# EAGLE design Teensy-Maxuino-Slave-A4988-stepper 2x shield v3 (EAGLE 6.4)
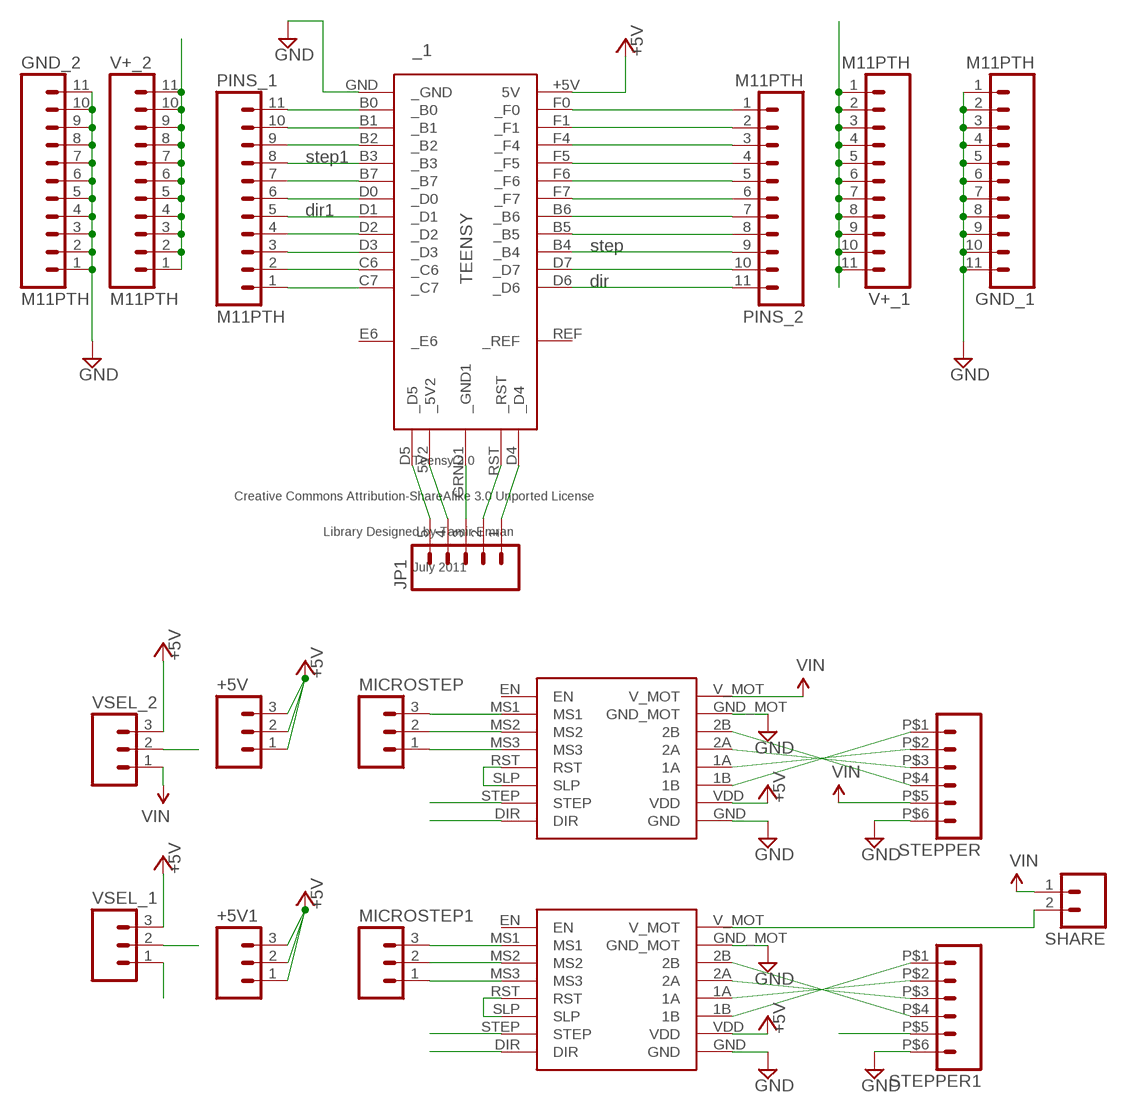
[diagram p0: schematic, sheet 1]

## Parts
+5V  M03PTH  [1X03]
+5V1  M03PTH  [1X03]
_1  TEENSY  [TEENSY]
A4988_1  POLOLU_A4988  [POLOLU_A4988]
A4988_2  POLOLU_A4988  [POLOLU_A4988]
GND_1  M11PTH  [1X11]
GND_2  M11PTH  [1X11]
JP1  M05PTH  [1X05]
MICROSTEP  M03PTH  [1X03]
MICROSTEP1  M03PTH  [1X03]
PINS_1  M11PTH  [1X11]
PINS_2  M11PTH  [1X11]
SHARE  M02PTH  [1X02]
STEPPER  M06  [SPRINGTERMINAL-2.54MM-6]
STEPPER1  M06  [SPRINGTERMINAL-2.54MM-6]
V+_1  M11PTH  [1X11]
V+_2  M11PTH  [1X11]
VSEL_1  M03PTH  [1X03]
VSEL_2  M03PTH  [1X03]

## Nets
+5V: +5V1.1 +5V1.2 +5V1.3 +5V.1 +5V.2 +5V.3 _1.5V2(_5V2) _1.+5V(5V) A4988_1.VDD A4988_2.VDD JP1.4 VSEL_1.3 VSEL_2.3
DIR: _1.D6(_D6) A4988_1.DIR PINS_2.11
DIR1: _1.D1(_D1) A4988_2.DIR PINS_1.5
GND [GND]: _1.GND(_GND) _1.GRND1(_GND1) A4988_1.GND A4988_1.GND_MOT A4988_2.GND A4988_2.GND_MOT GND_1.1 GND_1.2 GND_1.3 GND_1.4 GND_1.5 GND_1.6 GND_1.7 GND_1.8 GND_1.9 GND_1.10 GND_1.11 GND_2.1 GND_2.2 GND_2.3 GND_2.4 GND_2.5 GND_2.6 GND_2.7 GND_2.8 GND_2.9 GND_2.10 GND_2.11 JP1.3 STEPPER1.P$6 STEPPER.P$6
N$1 [Power]: A4988_1.2B STEPPER.P$4
N$2 [Power]: A4988_1.2A STEPPER.P$3
N$3 [Power]: A4988_1.1A STEPPER.P$2
N$4 [Power]: A4988_1.1B STEPPER.P$1
N$5: A4988_2.RST A4988_2.SLP
N$6: A4988_1.RST A4988_1.SLP
N$7: A4988_2.MS1 MICROSTEP1.3
N$8: A4988_1.MS1 MICROSTEP.3
N$9: A4988_1.MS2 MICROSTEP.2
N$10: A4988_1.MS3 MICROSTEP.1
N$11: A4988_2.MS2 MICROSTEP1.2
N$12: A4988_2.MS3 MICROSTEP1.1
N$13: A4988_2.2B STEPPER1.P$4
N$14 [Power]: A4988_2.2A STEPPER1.P$3
N$15 [Power]: A4988_2.1A STEPPER1.P$2
N$16 [Power]: A4988_2.1B STEPPER1.P$1
N$17: _1.B0(_B0) PINS_1.11
N$18: _1.D0(_D0) PINS_1.6
N$19: _1.B7(_B7) PINS_1.7
N$20: _1.C6(_C6) PINS_1.2
N$21: _1.D3(_D3) PINS_1.3
N$22: _1.D2(_D2) PINS_1.4
N$23: _1.C7(_C7) PINS_1.1
N$24: _1.B2(_B2) PINS_1.9
N$25: _1.B1(_B1) PINS_1.10
N$26: _1.F4(_F4) PINS_2.3
N$27: _1.F5(_F5) PINS_2.4
N$28: _1.F6(_F6) PINS_2.5
N$29: _1.F7(_F7) PINS_2.6
N$30: _1.B6(_B6) PINS_2.7
N$31: _1.B5(_B5) PINS_2.8
N$32: _1.D7(_D7) PINS_2.10
N$33: _1.F0(_F0) PINS_2.1
N$34: _1.F1(_F1) PINS_2.2
N$35: _1.D5(_D5) JP1.5
N$38: _1.RST(_RST) JP1.2
N$39: _1.D4(_D4) JP1.1
STEP: _1.B4(_B4) A4988_1.STEP PINS_2.9
STEP1: _1.B3(_B3) A4988_2.STEP PINS_1.8
V+_1: V+_1.1 V+_1.2 V+_1.3 V+_1.4 V+_1.5 V+_1.6 V+_1.7 V+_1.8 V+_1.9 V+_1.10 V+_1.11 VSEL_1.2
V+_2: V+_2.1 V+_2.2 V+_2.3 V+_2.4 V+_2.5 V+_2.6 V+_2.7 V+_2.8 V+_2.9 V+_2.10 V+_2.11 VSEL_2.2
VIN [Power]: A4988_1.V_MOT SHARE.1 STEPPER.P$5 VSEL_2.1
VIN_2 [Power]: A4988_2.V_MOT SHARE.2 STEPPER1.P$5 VSEL_1.1
Unconnected: _1.E6(_E6) _1.REF(_REF) A4988_1.EN A4988_2.EN

## Notes on the sheet
- step1
- dir1
- step
- dir

## Library data of the parts
+5V +5V1 MICROSTEP MICROSTEP1 VSEL_1 VSEL_2 = SparkFun-Connectors:M03: Header 3 Standard 3-pin 0.1" header. Use with straight break away headers (SKU : PRT-00116), right angle break away headers (PRT-00553), swiss pins (PRT-00743), machine pins (PRT-00117), and female headers (PRT-00115). Molex polarized connector foot print use with SKU : PRT-08232 with associated crimp pins and housings.
_1 = aliEagleLib:TEENSY: Teensy 2.0 Original Design by Clint Fisher Modified Design by Tamir Emran Licensed Under Creative Commons Attribution-ShareAlike 3.0 Unported (CC BY-SA 3.0)
A4988_1 A4988_2 = aliEagleLib:POLOLU_A4988
GND_1 GND_2 PINS_1 PINS_2 V+_1 V+_2 = SparkFun-Connectors:M11: Header 11 Standard 11-pin 0.1" header. Use with straight break away headers (SKU : PRT-00116), right angle break away headers (PRT-00553), swiss pins (PRT-00743), machine pins (PRT-00117), and female headers (PRT-00115).
JP1 = SparkFun-Connectors:M05: Header 5 Standard 5-pin 0.1" header. Use with straight break away headers (SKU : PRT-00116), right angle break away headers (PRT-00553), swiss pins (PRT-00743), machine pins (PRT-00117), and female headers (PRT-00115). Molex polarized connector foot print use with SKU : PRT-08230 with associated crimp pins and housings.
SHARE = SparkFun-Connectors:M02: Header 2 Standard 2-pin 0.1" header. Use with straight break away headers (SKU : PRT-00116), right angle break away headers (PRT-00553), swiss pins (PRT-00743), machine pins (PRT-00117), and female headers (PRT-00115). Molex polarized connector foot print use with SKU : PRT-08233 with associated crimp pins and housings.
STEPPER STEPPER1 = aliEagleLib:M06: Header 6 Standard 6-pin 0.1" header. Use with straight break away headers (SKU : PRT-00116), right angle break away headers (PRT-00553), swiss pins (PRT-00743), machine pins (PRT-00117), and female headers (PRT-00115). Molex polarized connector foot print use with SKU : PRT-08094 with associated crimp pins and housings. NOTES ON THE VARIANTS LOCK and LOCK_LONGPADS... This footprint was designed to help hold the alignment of a through-hole component (i.e. 6-pin header) while soldering it into place. You may notice that each hole has been shifted either up or down by 0.005 of an inch from it's more standard position (which is a perfectly straight line). This slight alteration caused the pins (the squares in the middle) to touch the edges of the holes. Because they are alternating, it causes a "brace" to hold the component in place. 0.005 has proven to be the perfect amount of "off-center" position when using our standard breakaway headers. Although looks a little odd when you look at the bare footprint, once you have a header in there, the alteration is very hard to notice. Also, if you push a header all the way into place, it is covered up entirely on the bottom side. This idea of altering the position of holes to aid alignment will be further integrated into the Sparkfun Library for other footprints. It can help hold any component with 3 or more connection pins.

## Net classes
0 default: width 0.152 mm, clearance 0.152 mm
1 GND: width 0.406 mm, clearance 0.152 mm
2 Power: width 0.406 mm, clearance 0.152 mm

## Board
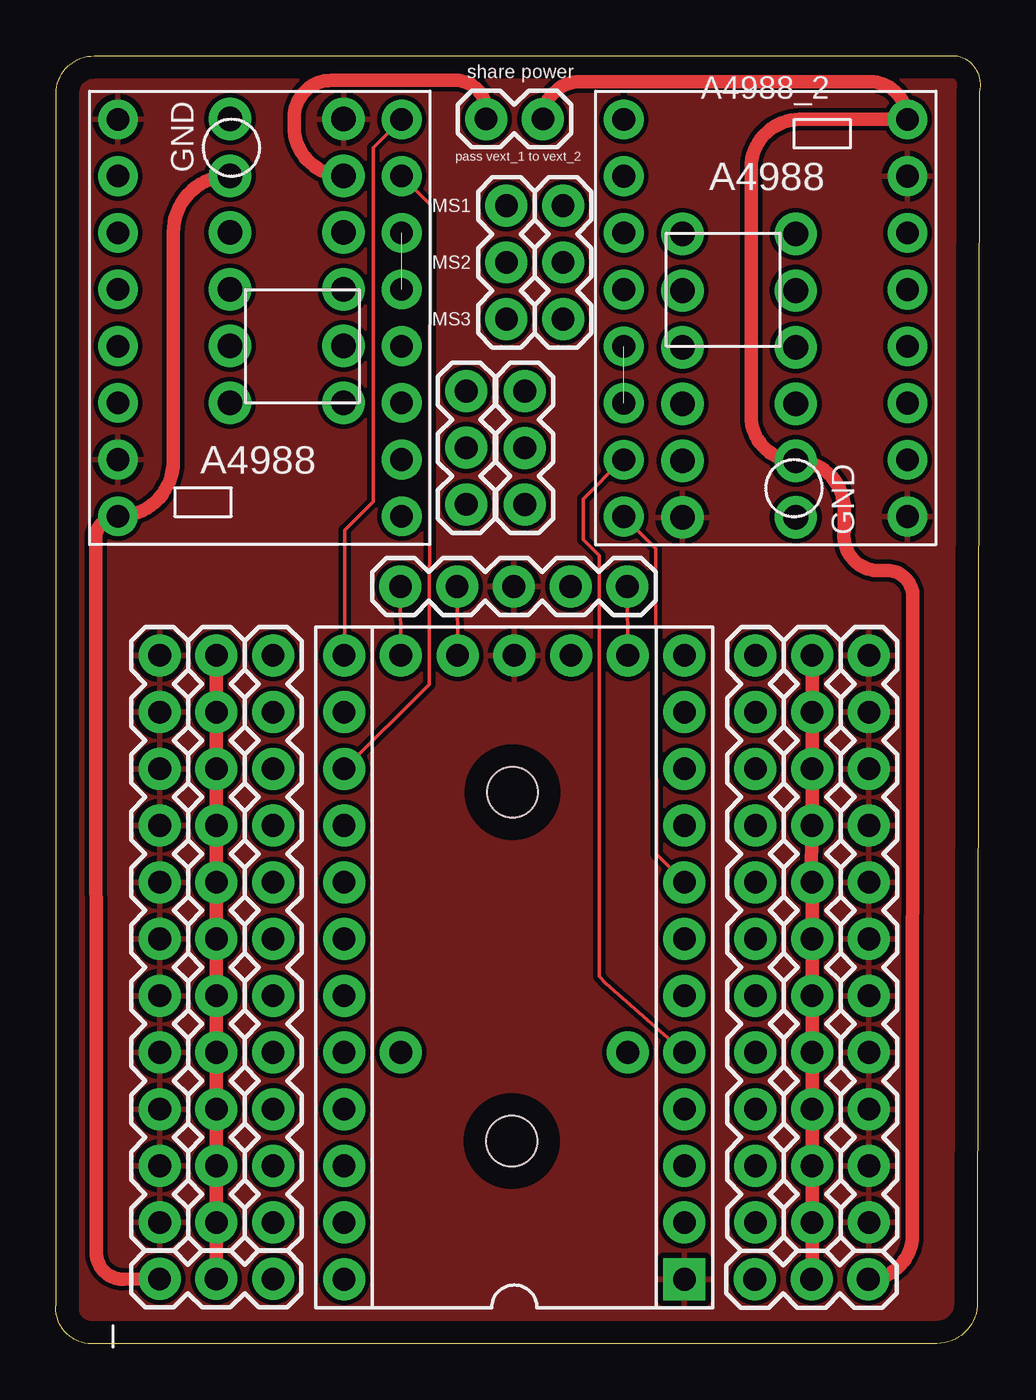
[diagram p1: board, top side]
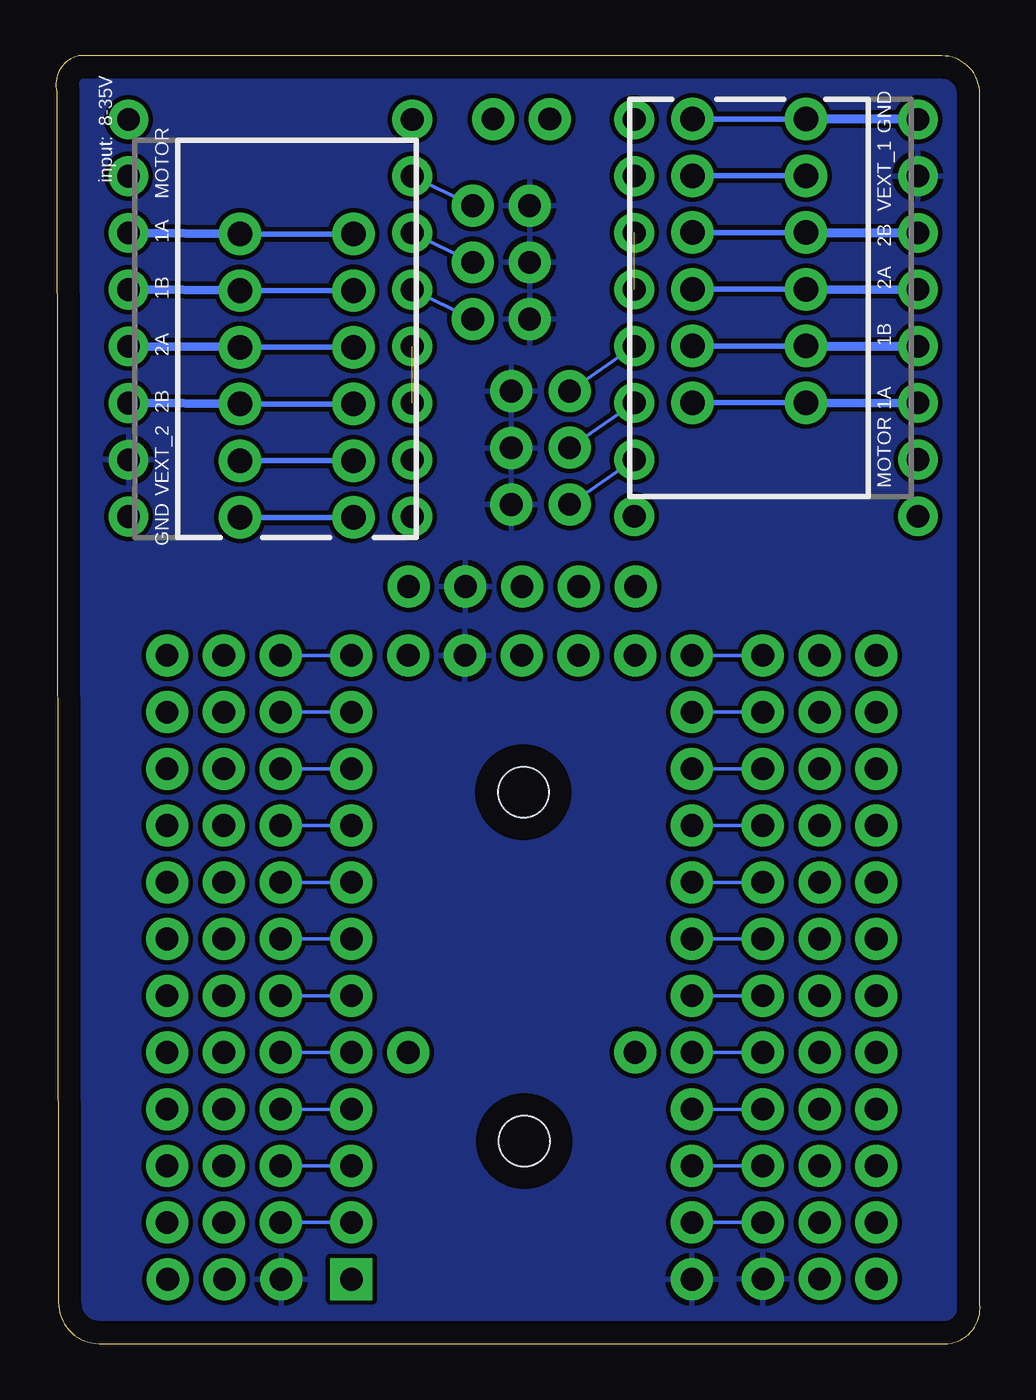
[diagram p2: board, bottom side, seen from below]

Size 41.38 x 57.68 mm. Coordinates in mm from the lower left corner, seen from the top.
Outline: 0.01,1.76 0.01,55.97 arc-90 1.72,57.68 40.36,57.68 arc-90 41.34,56.07 41.26,1.85 arc-90 39.45,0 1.44,0 arc-90 0.01,1.76
Copper layers (1*16): Top 0.035mm / dielectric 1.5mm / Bottom 0.035mm
Design rules "default *": minimum track width 6mil, minimum drill 24mil, track to track 8mil, track to pad 8mil, pad to pad 8mil, via to via 8mil, smd to smd 8mil, copper to edge 40mil, drill to drill 6mil, minimum pad ring 10mil, minimum via ring 8mil, stop-mask expansion 4mil, vias tented up to drill 0mil, thermal gap 10mil
Holes 2.26 mm at 20.41,9.07 20.44,24.7

### Footprints (pad centres in the part's own frame; a part is rotated, then mirrored left to right if it is on the bottom)
1X03 = drill 1.016 pad 1.88: 1 0,0; 2 2.54,0; 3 5.08,0
TEENSY = drill 1.016 pad 1.88: 5V2 13.97,-2.54; +5V -13.97,7.62; B0 -11.43,-7.62; B1 -8.89,-7.62; B2 -6.35,-7.62; B3 -3.81,-7.62; B4 8.89,7.62; B5 6.35,7.62; B6 3.81,7.62; B7 -1.27,-7.62; C6 11.43,-7.62; C7 13.97,-7.62; D0 1.27,-7.62; D1 3.81,-7.62; D2 6.35,-7.62; D3 8.89,-7.62; D4 13.97,5.08; D5 13.97,-5.08; D6 13.97,7.62; D7 11.43,7.62; E6 -3.81,-5.08; F0 -11.43,7.62; F1 -8.89,7.62; F4 -6.35,7.62; F5 -3.81,7.62; F6 -1.27,7.62; F7 1.27,7.62; GRND1 13.97,0; REF -3.81,5.08; RST 13.97,2.54 | drill 1.016 pad 1.88 square: GND -13.97,-7.62
POLOLU_A4988 = drill 1.016 pad 1.778: 1A 6.35,-1.27; 1B 6.35,-3.81; 2A 6.35,1.27; 2B 6.35,3.81; DIR -6.35,-8.89; EN -6.35,8.89; GND 6.35,-8.89; GND_MOT 6.35,6.35; MS1 -6.35,6.35; MS2 -6.35,3.81; MS3 -6.35,1.27; RST -6.35,-1.27; SLP -6.35,-3.81; STEP -6.35,-6.35; V_MOT 6.35,8.89; VDD 6.35,-6.35
1X11 = drill 1.016 pad 1.88: 1 0,0; 2 2.54,0; 3 5.08,0; 4 7.62,0; 5 10.16,0; 6 12.7,0; 7 15.24,0; 8 17.78,0; 9 20.32,0; 10 22.86,0; 11 25.4,0
1X05 = drill 1.016 pad 1.88: 1 0,0; 2 2.54,0; 3 5.08,0; 4 7.62,0; 5 10.16,0
1X02 = drill 1.016 pad 1.88: 1 0,0; 2 2.54,0
SPRINGTERMINAL-2.54MM-6 = drill 1.1 pad 1.9: 1 2.54,-2.54; 2 0,-2.54; 3 -2.54,-2.54; 4 -5.08,-2.54; 5 5.08,-2.54; 6 7.62,-2.54; P$1 2.54,2.54; P$2 0,2.54; P$3 -2.54,2.54; P$4 -5.08,2.54; P$5 5.08,2.54; P$6 7.62,2.54

### Placement (x,y rotation side)
+5V  20.99,37.58 90 top
+5V1  20.17,45.89 90 top
_1  20.52,16.85 90 top
A4988_1  9.13,45.94 180 top
A4988_2  31.77,45.93 0 top
GND_1  36.4,30.82 270 top
GND_2  4.65,30.82 270 top
JP1  15.42,33.91 0 top
MICROSTEP  18.38,42.66 270 top
MICROSTEP1  22.71,45.89 90 top
PINS_1  31.32,30.82 270 top
PINS_2  9.73,5.42 90 top
SHARE  19.26,54.85 0 top
STEPPER  10.34,47.22 90 bottom
STEPPER1  30.59,44.62 270 bottom
V+_1  33.86,30.82 270 top
V+_2  7.19,30.82 270 top
VSEL_1  36.37,2.88 180 top
VSEL_2  4.64,2.9 0 top

### Tracks (layer width: path | path; a pad name or v marks a point on that pad's centre or on a via)
+5V
  pour Bottom: 40.97,57.71 40.97,0.49 0.96,0.49 0.96,57.39
DIR
  Top 0.152: A4988_1.DIR 14.21,53.56 14.21,37.72 12.93,36.44 12.93,30.85 _1.D6
  Bottom 0.152: _1.D6 PINS_2.11
DIR1
  Top 0.152: _1.D1 26.89,21.92 26.86,35.61 A4988_2.DIR
  Bottom 0.152: PINS_1.5 _1.D1
GND
  Bottom 0.406: A4988_1.GND 7.8,54.84
  pour Top: 0.35,2.81 arc90 1.8,0.44 39.42,0.44 arc90 40.86,1.99 41.15,56.29 arc90 39.91,57.22 0.41,57.25
N$1
  Bottom 0.406: 7.8,42.14 A4988_1.2B
N$2
  Bottom 0.406: 7.8,44.68 A4988_1.2A
N$3
  Bottom 0.406: 7.8,47.22 A4988_1.1A
N$4
  Bottom 0.406: 7.8,49.76 A4988_1.1B
N$5  (1 unrouted)
N$6  (1 unrouted)
N$7
  Bottom 0.152: MICROSTEP1.3 A4988_2.MS1
N$8
  Bottom 0.152: MICROSTEP.3 A4988_1.MS1
N$9
  Bottom 0.152: A4988_1.MS2 MICROSTEP.2
N$10
  Bottom 0.152: MICROSTEP.1 A4988_1.MS3
N$11
  Bottom 0.152: A4988_2.MS2 MICROSTEP1.2
N$12
  Bottom 0.152: MICROSTEP1.1 A4988_2.MS3
N$13
  Bottom 0.406: 33.13,49.7 A4988_2.2B
N$14
  Bottom 0.406: 33.13,47.16 A4988_2.2A
N$15
  Bottom 0.406: 33.13,44.62 A4988_2.1A
N$16
  Bottom 0.406: 33.13,42.08 A4988_2.1B
N$17
  Bottom 0.152: PINS_1.11 _1.B0
N$18
  Bottom 0.152: PINS_1.6 _1.D0
N$19
  Bottom 0.152: _1.B7 PINS_1.7
N$20
  Bottom 0.152: _1.C6 PINS_1.2
N$21
  Bottom 0.152: PINS_1.3 _1.D3
N$22
  Bottom 0.152: _1.D2 PINS_1.4
N$23
  Bottom 0.152: _1.C7 PINS_1.1
N$24
  Bottom 0.152: PINS_1.9 _1.B2
N$25
  Bottom 0.152: _1.B1 PINS_1.10
N$26
  Bottom 0.152: PINS_2.3 _1.F4
N$27
  Bottom 0.152: _1.F5 PINS_2.4
N$28
  Bottom 0.152: PINS_2.5 _1.F6
N$29
  Bottom 0.152: _1.F7 PINS_2.6
N$30
  Bottom 0.152: PINS_2.7 _1.B6
N$31
  Bottom 0.152: _1.B5 PINS_2.8
N$32
  Bottom 0.152: PINS_2.10 _1.D7
N$33
  Bottom 0.152: PINS_2.1 _1.F0
N$34
  Bottom 0.152: _1.F1 PINS_2.2
N$35
  Top 0.152: JP1.5 _1.D5
N$38
  Top 0.152: _1.RST JP1.2
N$39
  Top 0.152: JP1.1 _1.D4
STEP
  Top 0.152: _1.B4 16.71,29.53 16.76,51.02 A4988_1.STEP
  Bottom 0.152: _1.B4 PINS_2.9
STEP1
  Top 0.152: _1.B3 24.63,16.14 24.33,16.44 24.33,35.29 23.6,36.01 23.6,37.82 25.36,39.58 A4988_2.STEP
  Bottom 0.152: PINS_1.8 _1.B3
V+_1
  Top 0.61: V+_1.1 V+_1.2 V+_1.3 V+_1.4 33.81,20.71 V+_1.5 V+_1.6 V+_1.7 V+_1.8 V+_1.9 V+_1.10 V+_1.11 33.86,2.91 arc-90 VSEL_1.2
V+_2
  Top 0.61: V+_2.1 V+_2.2 V+_2.3 V+_2.4 V+_2.5 V+_2.6 V+_2.7 V+_2.8 V+_2.9 V+_2.10 V+_2.11 7.19,2.91 arc90 VSEL_2.2
VIN  (1 unrouted)
  Top 0.61: VSEL_2.1 3.01,2.88 arc-90 1.81,4.08 1.78,36.05 arc-90 A4988_1.V_MOT arc90 5.26,39.53 5.26,49.76 arc-90 7.8,52.3 | SHARE.1 19.26,55.2 arc90 17.88,56.58 12.34,56.58 arc90 10.66,54.9 10.66,54.52 arc90 STEPPER.P$5
VIN_2  (1 unrouted)
  Top 0.61: SHARE.2 arc-90 23.47,56.51 36.43,56.51 arc-90 A4988_2.V_MOT arc90 A4988_2.V_MOT 33.31,54.83 arc90 31.13,52.65 31.13,41.54 arc90 33.13,39.54 arc-90 35.3,37.37 35.3,36.43 arc90 36.62,34.63 37.09,34.63 arc-90 38.37,33.54 38.34,4.85 arc-90 VSEL_1.1